# Altium project base_tiempo.PrjPcb
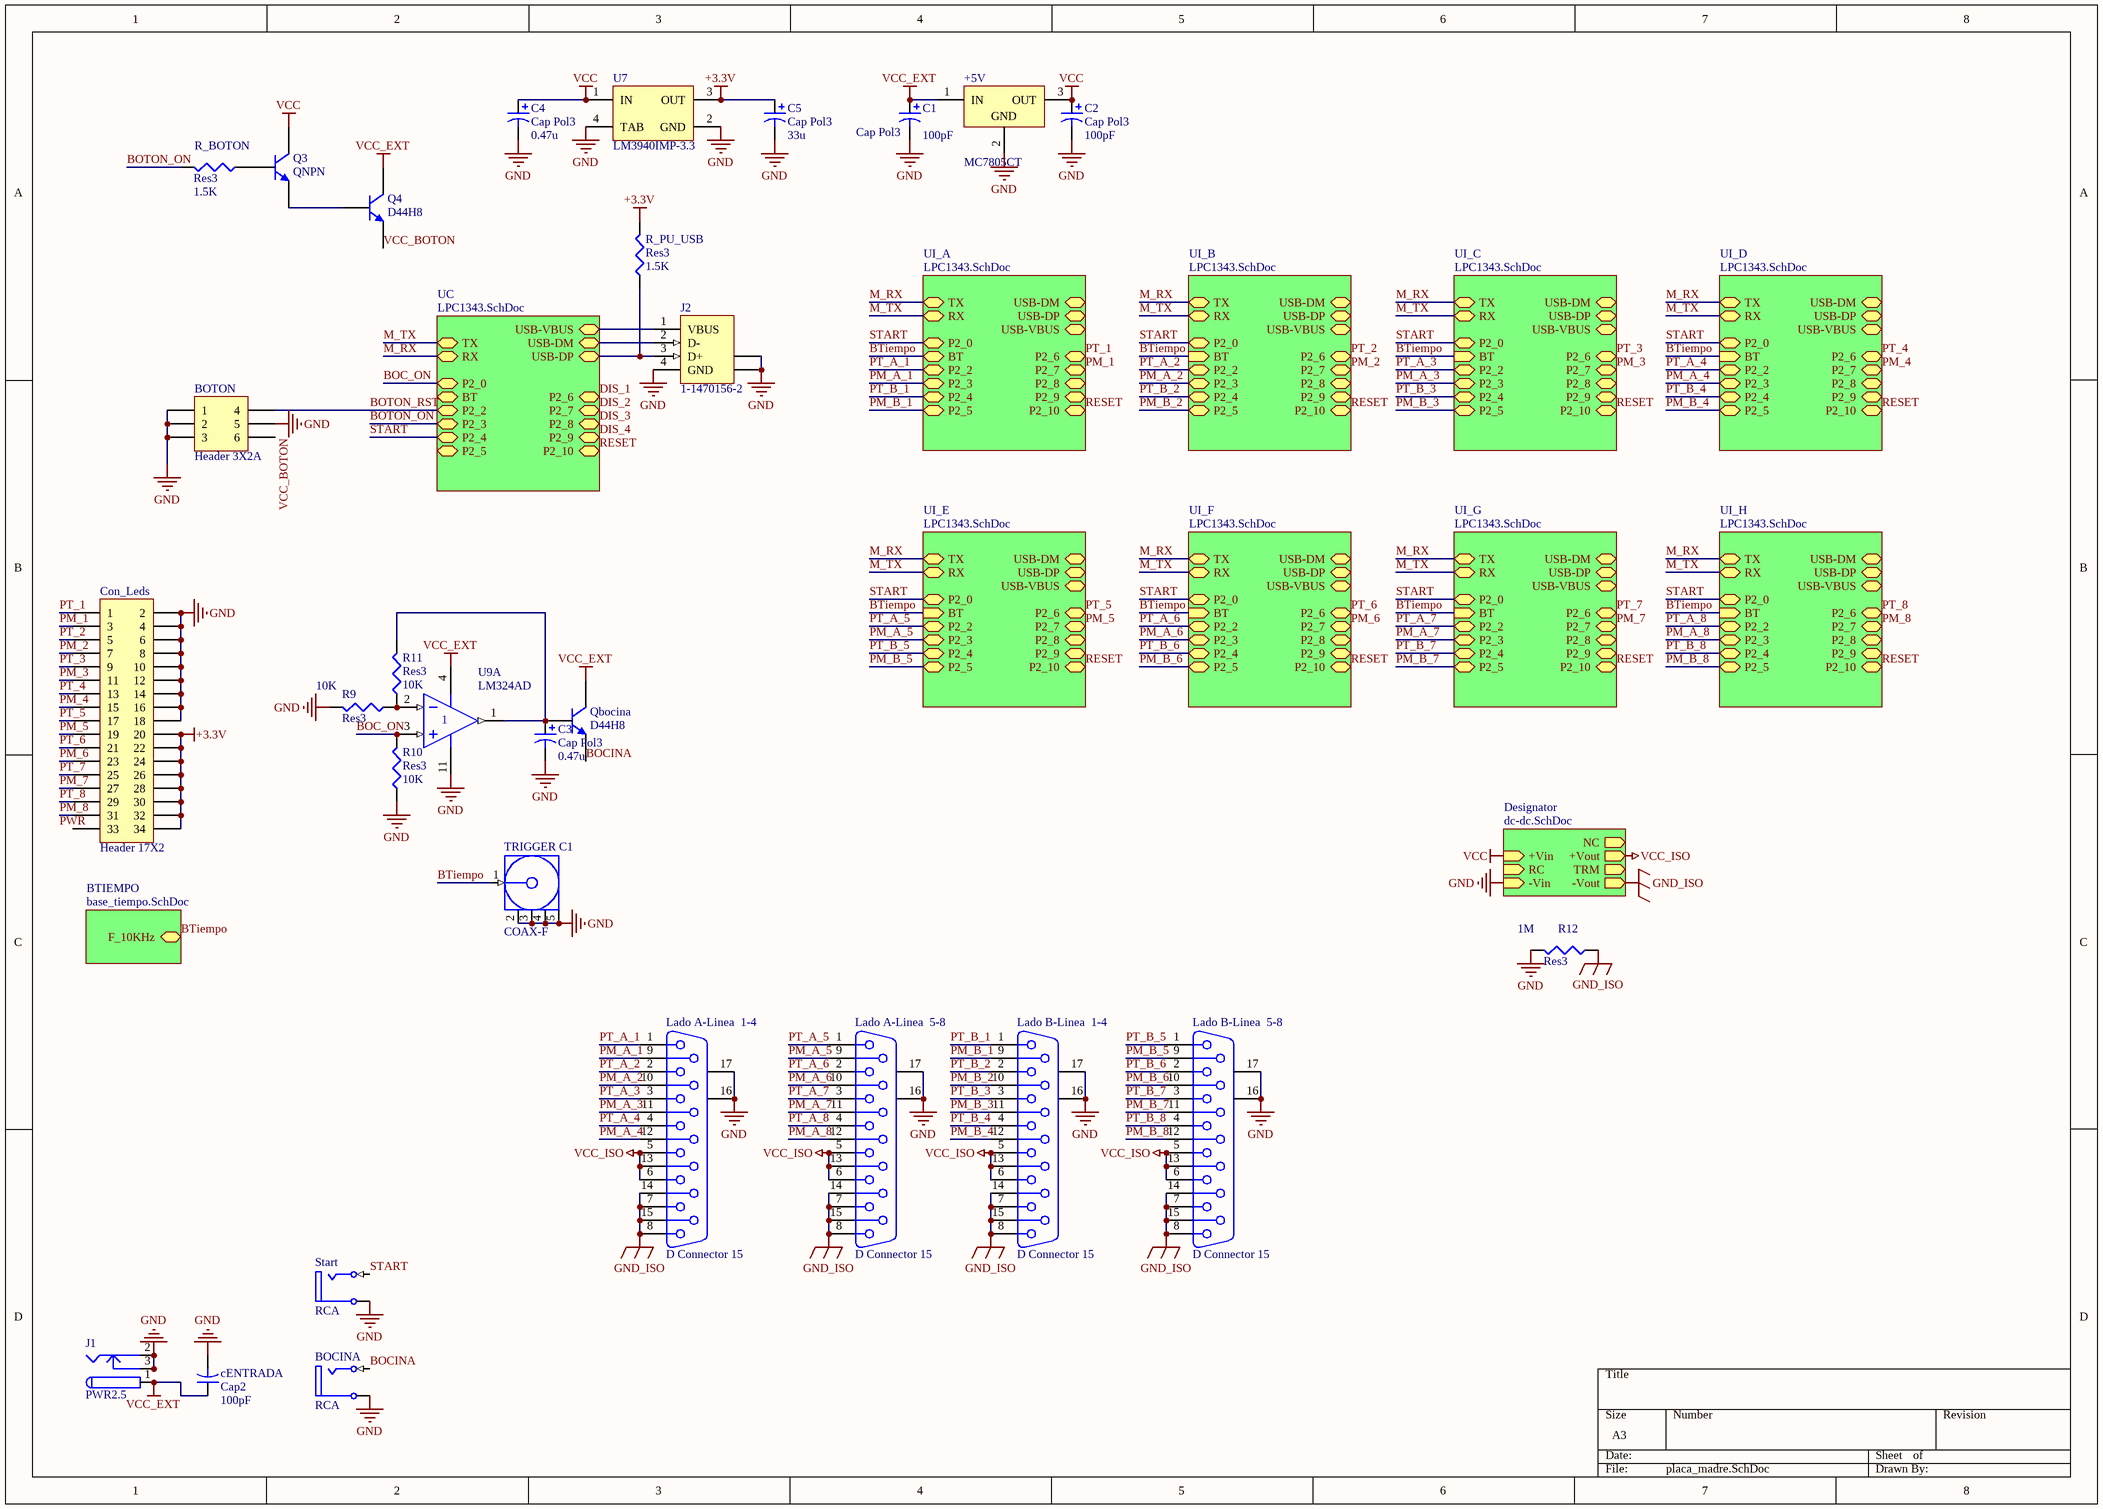
[diagram p0: placa_madre.SchDoc]
6 sheets, 185 parts. Net scope: hierarchical (ports join the sheet entries above them; power ports are global).
Board file: base_tiempo.PcbDoc
Sheets:
  placa_madre.SchDoc
    UI_A = LPC1343.SchDoc
    BTIEMPO = base_tiempo.SchDoc
      Buffer_5Bits = buffers_5bits.SchDoc
      AND_5_Entradas = AND_5_entradas.SchDoc
    UI_B = LPC1343.SchDoc
    UI_C = LPC1343.SchDoc
    UI_D = LPC1343.SchDoc
    UI_H = LPC1343.SchDoc
    UI_G = LPC1343.SchDoc
    UI_F = LPC1343.SchDoc
    UI_E = LPC1343.SchDoc
    UC = LPC1343.SchDoc
    Designator = dc-dc.SchDoc

## Sheet placa_madre.SchDoc
size A3

### Parts
+5V  MC7805CT  [221A-04]
BOCINA  RCA  [RCA/4.5-H2]
BOTON  Header 3X2A  [HDR2X3_CEN]
C1  Cap Pol3  value 100pF  [C0805]
C2  Cap Pol3  value 100pF  [C0805]
C3  Cap Pol3  value 0.47u  [C0805]
C4  Cap Pol3  value 0.47u  [C0805]
C5  Cap Pol3  value 33u  [C0805]
cENTRADA  Cap2  value 100pF  [CAPR5-4X5]
Con_Leds  Header 17X2  [HDR2X17]
J1  PWR2.5  [KLD-0202]
J2  1-1470156-2  [1-1470156]
Lado_A-Linea_1-4  D Connector 15  [DSUB1.385-2H15]
Lado_A-Linea_5-8  D Connector 15  [DSUB1.385-2H15]
Lado_B-Linea_1-4  D Connector 15  [DSUB1.385-2H15]
Lado_B-Linea_5-8  D Connector 15  [DSUB1.385-2H15]
Q3  QNPN  [SOT-23B]
Q4  D44H8  [TO-220]
Qbocina  D44H8  [TO-220]
R9  Res3  value 10K  [2012[0805]]
R10  Res3  value 10K  [2012[0805]]
R11  Res3  value 10K  [2012[0805]]
R12  Res3  value 1M  [2012[0805]]
R_BOTON  Res3  value 1.5K  [J1-0603]
R_PU_USB  Res3  value 1.5K  [2012[0805]]
Start  RCA  [RCA/4.5-H2]
TRIGGER_C1  COAX-F  [MCX5.08-H5]
U7  LM3940IMP-3.3  [MP04A_N]
U9  LM324AD  [751A-02_N]  (part A of 4)

### Sub-sheets
BTIEMPO = base_tiempo.SchDoc: F_10KHz (bidir)
Designator = dc-dc.SchDoc: -Vin (in), +Vin (in), +Vout (out), -Vout (out), RC (in), TRM (out), NC (out)
UC = LPC1343.SchDoc: TX (bidir), RX (bidir), P2_0 (bidir), BT (bidir), P2_2 (bidir), P2_3 (bidir), P2_4 (bidir), P2_5 (bidir), P2_6 (bidir), P2_7 (bidir), P2_8 (bidir), P2_9 (bidir), P2_10 (bidir), USB-DM (bidir), USB-DP (bidir), USB-VBUS
UI_A = LPC1343.SchDoc: TX (bidir), RX (bidir), P2_0 (bidir), BT (bidir), P2_2 (bidir), P2_3 (bidir), P2_4 (bidir), P2_5 (bidir), P2_6 (bidir), P2_7 (bidir), P2_8 (bidir), P2_9 (bidir), P2_10 (bidir), USB-DM (bidir), USB-DP (bidir), USB-VBUS (bidir)
UI_B = LPC1343.SchDoc: TX (bidir), RX (bidir), P2_0 (bidir), BT (in), P2_2 (bidir), P2_3 (bidir), P2_4 (bidir), P2_5 (bidir), P2_6 (bidir), P2_7 (bidir), P2_8 (bidir), P2_9 (bidir), P2_10 (bidir), USB-DM (bidir), USB-DP (bidir), USB-VBUS (bidir)
UI_C = LPC1343.SchDoc: TX (bidir), RX (bidir), P2_0 (bidir), BT (in), P2_2 (bidir), P2_3 (bidir), P2_4 (bidir), P2_5 (bidir), P2_6 (bidir), P2_7 (bidir), P2_8 (bidir), P2_9 (bidir), P2_10 (bidir), USB-DM (bidir), USB-DP (bidir), USB-VBUS (bidir)
UI_D = LPC1343.SchDoc: TX (bidir), RX (bidir), P2_0 (bidir), BT (in), P2_2 (bidir), P2_3 (bidir), P2_4 (bidir), P2_5 (bidir), P2_6 (bidir), P2_7 (bidir), P2_8 (bidir), P2_9 (bidir), P2_10 (bidir), USB-DM (bidir), USB-DP (bidir), USB-VBUS (bidir)
UI_E = LPC1343.SchDoc: TX (bidir), RX (bidir), P2_0 (bidir), BT (in), P2_2 (bidir), P2_3 (bidir), P2_4 (bidir), P2_5 (bidir), P2_6 (bidir), P2_7 (bidir), P2_8 (bidir), P2_9 (bidir), P2_10 (bidir), USB-DM (bidir), USB-DP (bidir), USB-VBUS (bidir)
UI_F = LPC1343.SchDoc: TX (bidir), RX (bidir), P2_0 (bidir), BT (in), P2_2 (bidir), P2_3 (bidir), P2_4 (bidir), P2_5 (bidir), P2_6 (bidir), P2_7 (bidir), P2_8 (bidir), P2_9 (bidir), P2_10 (bidir), USB-DM (bidir), USB-DP (bidir), USB-VBUS (bidir)
UI_G = LPC1343.SchDoc: TX (bidir), RX (bidir), P2_0 (bidir), BT (in), P2_2 (bidir), P2_3 (bidir), P2_4 (bidir), P2_5 (bidir), P2_6 (bidir), P2_7 (bidir), P2_8 (bidir), P2_9 (bidir), P2_10 (bidir), USB-DM (bidir), USB-DP (bidir), USB-VBUS (bidir)
UI_H = LPC1343.SchDoc: TX (bidir), RX (bidir), P2_0 (bidir), BT (in), P2_2 (bidir), P2_3 (bidir), P2_4 (bidir), P2_5 (bidir), P2_6 (bidir), P2_7 (bidir), P2_8 (bidir), P2_9 (bidir), P2_10 (bidir), USB-DM (bidir), USB-DP (bidir), USB-VBUS (bidir)

### Nets
+3.3V: C5.1 Con_Leds.20 Con_Leds.22 Con_Leds.24 Con_Leds.26 Con_Leds.28 Con_Leds.30 Con_Leds.32 Con_Leds.34 R_PU_USB.2 U7.3(OUT)
GND: +5V.2(GND) BOCINA.1A(Ground) BOTON.1 BOTON.2 BOTON.3 BOTON.5 C1.2 C2.2 C3.2 C4.2 C5.2 cENTRADA.2 Con_Leds.2 Con_Leds.4 Con_Leds.6 Con_Leds.8 Con_Leds.10 Con_Leds.12 Con_Leds.14 Con_Leds.16 Con_Leds.18 J1.2 J1.2A J1.2B J1.3 J1.3A J1.3B J2.4(GND) J2.5(SHLD) J2.6(SHLD) Lado_A-Linea_1-4.16(MH1) Lado_A-Linea_1-4.17(MH2) Lado_A-Linea_5-8.16(MH1) Lado_A-Linea_5-8.17(MH2) Lado_B-Linea_1-4.16(MH1) Lado_B-Linea_1-4.17(MH2) Lado_B-Linea_5-8.16(MH1) Lado_B-Linea_5-8.17(MH2) R9.2 R10.1 R12.2 Start.1A(Ground) TRIGGER_C1.2(GND) TRIGGER_C1.3(GND) TRIGGER_C1.4(GND) TRIGGER_C1.5(GND) U7.2(GND) U7.4(TAB) U9.11(V-) ; sheet Designator/-Vin
GND_ISO: Lado_A-Linea_1-4.7 Lado_A-Linea_1-4.8 Lado_A-Linea_1-4.14 Lado_A-Linea_1-4.15 Lado_A-Linea_5-8.7 Lado_A-Linea_5-8.8 Lado_A-Linea_5-8.14 Lado_A-Linea_5-8.15 Lado_B-Linea_1-4.7 Lado_B-Linea_1-4.8 Lado_B-Linea_1-4.14 Lado_B-Linea_1-4.15 Lado_B-Linea_5-8.7 Lado_B-Linea_5-8.8 Lado_B-Linea_5-8.14 Lado_B-Linea_5-8.15 R12.1 ; sheet Designator/-Vout
VCC: +5V.3(OUT) C2.1 C4.1 Q3.1(C) U7.1(IN) ; sheet Designator/+Vin
VCC_EXT: +5V.1(IN) C1.1 cENTRADA.1 J1.1 J1.1A J1.1B Q4.2(C) Qbocina.2(C) U9.4(V+)
VCC_ISO: Lado_A-Linea_1-4.5 Lado_A-Linea_1-4.6 Lado_A-Linea_1-4.13 Lado_A-Linea_5-8.5 Lado_A-Linea_5-8.6 Lado_A-Linea_5-8.13 Lado_B-Linea_1-4.5 Lado_B-Linea_1-4.6 Lado_B-Linea_1-4.13 Lado_B-Linea_5-8.5 Lado_B-Linea_5-8.6 Lado_B-Linea_5-8.13 ; sheet Designator/+Vout
36: J2.2(D-) ; sheet UC/USB-DM
37: J2.3(D+) R_PU_USB.1 ; sheet UC/USB-DP
39: J2.1(VBUS) ; sheet UC/USB-VBUS
BOC_ON: R10.2 U9.3(IN+) ; sheet UC/P2_0  [project net 12]
BOCINA: BOCINA.2B(Signal) Qbocina.3(E)
BOTON_ON: R_BOTON.2 ; sheet UC/P2_3  [project net 45]
BOTON_RST: BOTON.4 ; sheet UC/P2_2  [project net 14]
BTiempo: TRIGGER_C1.1(Signal) ; sheet UI_A/BT, sheet BTIEMPO/F_10KHz, sheet UI_B/BT, sheet UI_C/BT, sheet UI_D/BT, sheet UI_H/BT, sheet UI_G/BT, sheet UI_F/BT, sheet UI_E/BT  [project net 10KHz]
M_RX: sheet UI_A/TX, sheet UI_B/TX, sheet UI_C/TX, sheet UI_D/TX, sheet UI_H/TX, sheet UI_G/TX, sheet UI_F/TX, sheet UI_E/TX, sheet UC/RX  [project net 10]
M_TX: sheet UI_A/RX, sheet UI_B/RX, sheet UI_C/RX, sheet UI_D/RX, sheet UI_H/RX, sheet UI_G/RX, sheet UI_F/RX, sheet UI_E/RX, sheet UC/TX  [project net 10]
PM_1: Con_Leds.3 ; sheet UI_A/P2_7  [project net 49]
PM_2: Con_Leds.7 ; sheet UI_B/P2_7  [project net 49]
PM_3: Con_Leds.11 ; sheet UI_C/P2_7  [project net 49]
PM_4: Con_Leds.15 ; sheet UI_D/P2_7  [project net 49]
PM_5: Con_Leds.19 ; sheet UI_E/P2_7  [project net 49]
PM_6: Con_Leds.23 ; sheet UI_F/P2_7  [project net 49]
PM_7: Con_Leds.27 ; sheet UI_G/P2_7  [project net 49]
PM_8: Con_Leds.31 ; sheet UI_H/P2_7  [project net 49]
PM_A_1: Lado_A-Linea_1-4.9 ; sheet UI_A/P2_3  [project net 45]
PM_A_2: Lado_A-Linea_1-4.10 ; sheet UI_B/P2_3  [project net 45]
PM_A_3: Lado_A-Linea_1-4.11 ; sheet UI_C/P2_3  [project net 45]
PM_A_4: Lado_A-Linea_1-4.12 ; sheet UI_D/P2_3  [project net 45]
PM_A_5: Lado_A-Linea_5-8.9 ; sheet UI_E/P2_3  [project net 45]
PM_A_6: Lado_A-Linea_5-8.10 ; sheet UI_F/P2_3  [project net 45]
PM_A_7: Lado_A-Linea_5-8.11 ; sheet UI_G/P2_3  [project net 45]
PM_A_8: Lado_A-Linea_5-8.12 ; sheet UI_H/P2_3  [project net 45]
PM_B_1: Lado_B-Linea_1-4.9 ; sheet UI_A/P2_5  [project net 47]
PM_B_2: Lado_B-Linea_1-4.10 ; sheet UI_B/P2_5  [project net 47]
PM_B_3: Lado_B-Linea_1-4.11 ; sheet UI_C/P2_5  [project net 47]
PM_B_4: Lado_B-Linea_1-4.12 ; sheet UI_D/P2_5  [project net 47]
PM_B_5: Lado_B-Linea_5-8.9 ; sheet UI_E/P2_5  [project net 47]
PM_B_6: Lado_B-Linea_5-8.10 ; sheet UI_F/P2_5  [project net 47]
PM_B_7: Lado_B-Linea_5-8.11 ; sheet UI_G/P2_5  [project net 47]
PM_B_8: Lado_B-Linea_5-8.12 ; sheet UI_H/P2_5  [project net 47]
PT_1: Con_Leds.1 ; sheet UI_A/P2_6  [project net 48]
PT_2: Con_Leds.5 ; sheet UI_B/P2_6  [project net 48]
PT_3: Con_Leds.9 ; sheet UI_C/P2_6  [project net 48]
PT_4: Con_Leds.13 ; sheet UI_D/P2_6  [project net 48]
PT_5: Con_Leds.17 ; sheet UI_E/P2_6  [project net 48]
PT_6: Con_Leds.21 ; sheet UI_F/P2_6  [project net 48]
PT_7: Con_Leds.25 ; sheet UI_G/P2_6  [project net 48]
PT_8: Con_Leds.29 ; sheet UI_H/P2_6  [project net 48]
PT_A_1: Lado_A-Linea_1-4.1 ; sheet UI_A/P2_2  [project net 14]
PT_A_2: Lado_A-Linea_1-4.2 ; sheet UI_B/P2_2  [project net 14]
PT_A_3: Lado_A-Linea_1-4.3 ; sheet UI_C/P2_2  [project net 14]
PT_A_4: Lado_A-Linea_1-4.4 ; sheet UI_D/P2_2  [project net 14]
PT_A_5: Lado_A-Linea_5-8.1 ; sheet UI_E/P2_2  [project net 14]
PT_A_6: Lado_A-Linea_5-8.2 ; sheet UI_F/P2_2  [project net 14]
PT_A_7: Lado_A-Linea_5-8.3 ; sheet UI_G/P2_2  [project net 14]
PT_A_8: Lado_A-Linea_5-8.4 ; sheet UI_H/P2_2  [project net 14]
PT_B_1: Lado_B-Linea_1-4.1 ; sheet UI_A/P2_4  [project net 46]
PT_B_2: Lado_B-Linea_1-4.2 ; sheet UI_B/P2_4  [project net 46]
PT_B_3: Lado_B-Linea_1-4.3 ; sheet UI_C/P2_4  [project net 46]
PT_B_4: Lado_B-Linea_1-4.4 ; sheet UI_D/P2_4  [project net 46]
PT_B_5: Lado_B-Linea_5-8.1 ; sheet UI_E/P2_4  [project net 46]
PT_B_6: Lado_B-Linea_5-8.2 ; sheet UI_F/P2_4  [project net 46]
PT_B_7: Lado_B-Linea_5-8.3 ; sheet UI_G/P2_4  [project net 46]
PT_B_8: Lado_B-Linea_5-8.4 ; sheet UI_H/P2_4  [project net 46]
RESET: sheet UI_A/P2_10, sheet UI_B/P2_10, sheet UI_C/P2_10, sheet UI_D/P2_10, sheet UI_H/P2_10, sheet UI_G/P2_10, sheet UI_F/P2_10, sheet UI_E/P2_10, sheet UC/P2_10  [project net 52]
START: Start.2B(Signal) ; sheet UI_A/P2_0, sheet UI_B/P2_0, sheet UI_C/P2_0, sheet UI_D/P2_0, sheet UI_H/P2_0, sheet UI_G/P2_0, sheet UI_F/P2_0, sheet UI_E/P2_0, sheet UC/P2_4  [project net 12]
VCC_BOTON: BOTON.6 Q4.3(E)
NetC3_1: C3.1 Qbocina.1(B) R11.2 U9.1(OUT)
NetQ3_2: Q3.2(B) R_BOTON.1
NetQ3_3: Q3.3(E) Q4.1(B)
NetR9_1: R9.1 R11.1 U9.2(IN-)

Not connected (* = marked no-connect by the designer): Con_Leds 33

### Notes on the sheet
- Labels drawn without touching a wire or pin: PWR

### Library data of the parts
+5V = MC7805CT: 3-Terminal Positive Fixed Voltage Regulator; Note: Pin 2 is electrically connected to TAB; Published: 17-Jul-2002; DatasheetVersion: 1988; PackageReference: 221A-04; Publisher: Altium Limited; PackageDescription: TO, Thru-Hole, Vertical, Heatsink Mounted; 3 In-Line Leads; Pitch 2.54 mm; Code_JEDEC: TO-262-AA; ComponentLink1Description: Manufacturer Link; ComponentLink1URL: http://www.onsemi.com/site/products/taxonomy/0,4438,503,00.html; ComponentLink2Description: Datasheet; ComponentLink2URL: http://www.onsemi.com/pub/Collateral/MC7800-D.PDF
BOCINA Start = RCA: RCA Phono Jack, Right Angle, Thru-Hole, Snap-In; PCB_Layout: Complies with manufacturer's recommendation.; DrillAndSlotSize: Corresponds to nominal value.; Published: 15-Jul-2004; LatestRevisionDate: 15-Jul-2004; LatestRevisionNote: Component Replaced.; DatasheetDocument: 7-Jul-2000; PackageDocument: 7-Jul-2000; PackageReference: 161; Publisher: Altium Limited; ComponentLink1Description: Manufacturer Link; ComponentLink1URL: http://www.mouser.com/kobiconn/
BOTON = Header 3X2A: Header, 3-Pin, Dual row; LatestRevisionDate: 17-Jul-2002; LatestRevisionNote: Re-released for DXP Platform.; Publisher: Altium Limited
C1-C5 = Cap Pol3: Polarized Capacitor (Surface Mount); Published: 8-Jun-2000; LatestRevisionDate: 29-May-2009; LatestRevisionNote: IPC-7351 Footprint Added.; PackageReference: C0805; Publisher: Altium Limited; PackageDescription: Chip Capacitor
cENTRADA = Cap2: Capacitor; Published: 23-Sep-2002; PackageReference: CAPR5-4X5; Publisher: Altium Limited
Con_Leds = Header 17X2: Header, 17-Pin, Dual row; LatestRevisionDate: 17-Jul-2002; LatestRevisionNote: Re-released for DXP Platform.; Publisher: Altium Limited
J1 = PWR2.5: Low Voltage Power Supply Connector; Published: 17-Dec-2003; DatasheetDocument: 09-May-2002; Publisher: Altium Limited; ComponentLink1Description: Manufacturer Link; ComponentLink1URL: http://domino.kycon.com/internet/Products.html
J2 = 1-1470156-2: USB 1.1, Right Angle, Thru-Hole, B Type, Receptacle, 4 Position, Black; ContactMaterial: Phosphor Bronze; ContactPlating: Gold over Nickel; TerminationLength: 3.00mm [0.118in.]; PCB_Layout: Complies with manufacturer's recommendation.; DrillSize: Corresponds to nominal value.; PanelGround: Without; Published: 15-Jul-2004; DatasheetDocument: 02-Jun-2001; PackageDocument: 02-Jun-2001; PackageReference: 1-1470156; Publisher: Altium Limited; HousingMaterial: Glass-Filled Thermoplastic; ComponentLink1Description: Manufacturer Link; ComponentLink1URL: http://www.tycoelectronics.com/; ComponentLink2Description: Packaging Specification; ComponentLink2URL: http://ecommas.tycoelectronics.com/commerce/DocumentDelivery/DDEController?Action=showdoc&DocId=Customer+Drawing%7F1470156%7FO%7Ftif%7FEnglish%7FC_1470156_O.tif
Lado_A-Linea_1-4 Lado_A-Linea_5-8 Lado_B-Linea_1-4 Lado_B-Linea_5-8 = D Connector 15: Receptacle Assembly, 15 Position, Right Angle; PackageDocument: O; Positions: 15; Published: 15-Jun-2001; LatestRevisionDate: 17-Jul-2002; LatestRevisionNote: Re-released for DXP Platform.; DatasheetDocument: 1-Sep-99; PackageReference: 788757; Publisher: Altium Limited; Orientation: Right Angle; Gender: Receptacle
Q3 = QNPN: NPN Bipolar Transistor; Published: 8-Jun-2000; LatestRevisionDate: 17-Jul-2002; LatestRevisionNote: Re-released for DXP Platform.; PackageReference: SOT-23B; Publisher: Altium Limited; Code_JEDEC: SOT-23
Q4 Qbocina = D44H8: NPN Power Amplifier; Published: 8-Jun-2000; LatestRevisionDate: 17-Jul-2002; LatestRevisionNote: Re-released for DXP Platform.; DatasheetDocument: 1997; PackageDocument: Sep-1998; PackageReference: TO-220; Publisher: Altium Limited; Code_JEDEC: TO-220-AB-alt; ComponentLink1Description: Manufacturer Link; ComponentLink1URL: http://www.fairchildsemi.com/
R9-R12 R_BOTON R_PU_USB = Res3: Resistor; Published: 8-Jun-2000; LatestRevisionDate: 29-May-2009; LatestRevisionNote: IPC-7351 Footprint Added.; PackageReference: J1-0603; Publisher: Altium Limited; PackageDescription: Chip Resistor
TRIGGER_C1 = COAX-F: RF Coaxial PCB Connector, MCX; Thru-Hole, Right-Angle Mount Socket, Blunt Post Terminal, 50 Ohm Impedance; PCB_Layout: Complies with manufacturer's recommendation.; DrillSize: Corresponds to nominal value.; Published: 15-Jul-2004; LatestRevisionDate: 15-Jul-2004; LatestRevisionNote: Component Replaced.; DatasheetDocument: 30-May-2003; PackageDocument: 04-Jul-1999; PackageReference: 919-119J-51AX; Publisher: Altium Limited; ComponentLink1Description: Manufacturer Link; ComponentLink1URL: http://www.amphenolrf.com/
U7 = LM3940IMP-3.3: 1A Low Dropout Regulator for 5V to 3.3V Conversion, 4-pin SOT-223; Manufacturer: National Semiconductor; PackageTopMarking: XYTT*L52B; PowerWise: N; CompType: LDO IC; Published: 4-Dec-2008; DatasheetVersion: Jul-2007; PackageVersion: revB, Apr-2003; PackageReference: MP04A; Publisher: Altium Limited; PackageDescription: Molded SOT-223, 6.50 x 3.56 x 1.6mm Body, 4 Lead, 2.3mm Pitch; Supplier 1: Farnell; Supplier Part Number 1: 9779280; PartNumber: LM3940IMP-3.3; RoHS: N; PinCount: 4; Code_JEDEC: TO-261-AA; Code_IPC: SOT223-4; ComponentLink1Description: LM3940 Datasheet; ComponentLink1URL: http://www.national.com/ds/LM/LM3940.pdf; ComponentLink2Description: LM3940 Web Page; ComponentLink2URL: http://www.national.com/pf/LM/LM3940.html; ComponentLink3Description: MP04A Package Page; ComponentLink3URL: http://www.national.com/packaging/folders/mp04a.html
U9 = LM324AD: Quad Low-Power Operational Amplifier; Published: 17-Jul-2002; LatestRevisionDate: 13-Apr-2006; LatestRevisionNote: IPC-7351 Footprint Added.; DatasheetVersion: 1988; PackageVersion: 1991; PackageReference: 751A-02; Publisher: Altium Limited; PackageDescription: 14-Pin Small Outline Integrated Circuit 1.27 mm Pitch; Code_IPC: SOIC127P600-14; ComponentLink1Description: Manufacturer Link; ComponentLink1URL: http://www.onsemi.com/site/products/parametrics/0,4446,251,00.html; ComponentLink2Description: Datasheet; ComponentLink2URL: http://www.onsemi.com/pub/Collateral/LM324-D.PDF

## Sheet LPC1343.SchDoc
size A4
Used 9 times, as channels UI_A, UI_B, UI_C, UI_D, UI_H, UI_G, UI_F, UI_E, UC. Parts and nets are listed once, with the designators drawn on the sheet.
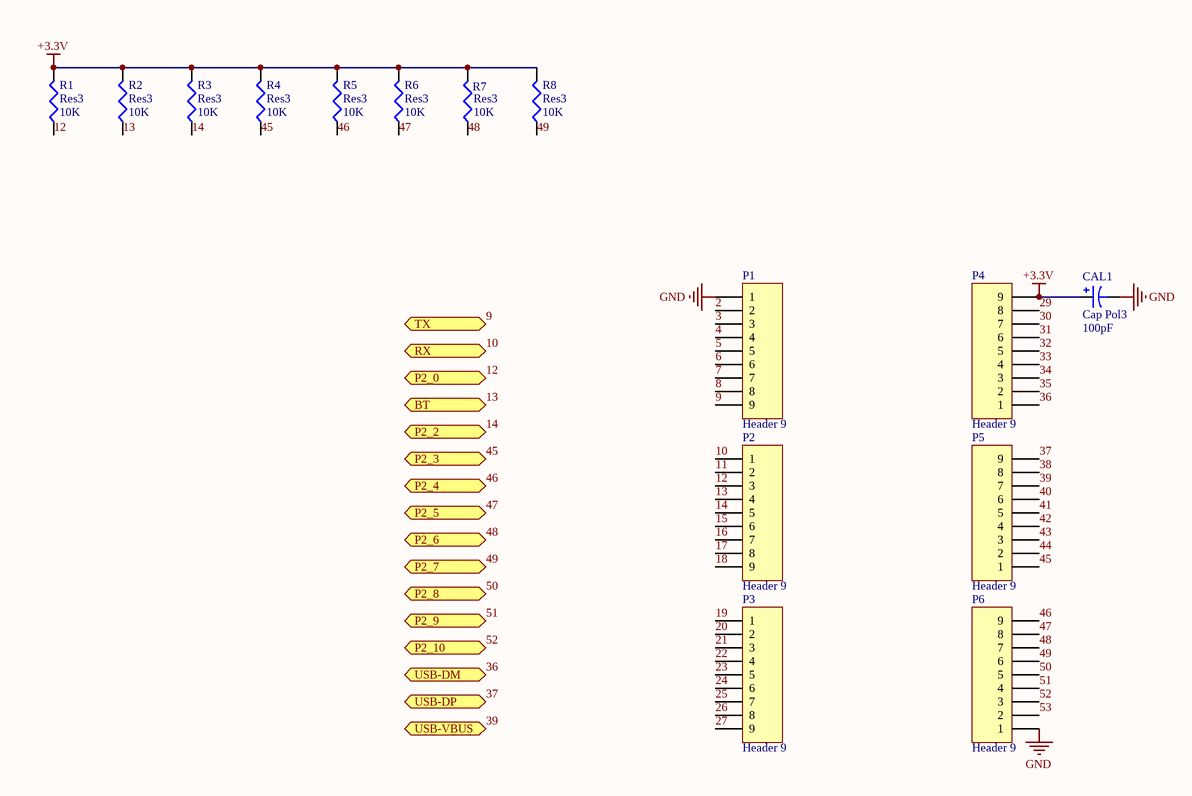
[diagram p1: LPC1343.SchDoc]

### Parts
CAL1  Cap Pol3  value 100pF  [C0805]
P1  Header 9  [HDR1X9]
P2  Header 9  [HDR1X9]
P3  Header 9  [HDR1X9]
P4  Header 9  [HDR1X9]
P5  Header 9  [HDR1X9]
P6  Header 9  [HDR1X9]
R1  Res3  value 10K  [2012[0805]]
R2  Res3  value 10K  [2012[0805]]
R3  Res3  value 10K  [2012[0805]]
R4  Res3  value 10K  [2012[0805]]
R5  Res3  value 10K  [2012[0805]]
R6  Res3  value 10K  [2012[0805]]
R7  Res3  value 10K  [2012[0805]]
R8  Res3  value 10K  [2012[0805]]

### Ports
BT (in), P2_0 (bidir), P2_2 (bidir), P2_3 (bidir), P2_4 (bidir), P2_5 (bidir), P2_6 (bidir), P2_7 (bidir), P2_8 (bidir), P2_9 (bidir), P2_10 (bidir), RX (bidir), TX (bidir), USB-DM (bidir), USB-DP (bidir), USB-VBUS

### Nets
+3.3V: CAL1.1 P4.9 R1.2 R2.2 R3.2 R4.2 R5.2 R6.2 R7.2 R8.2
GND: CAL1.2 P1.1 P6.1
2: P1.2
3: P1.3
4: P1.4
5: P1.5
6: P1.6
7: P1.7
8: P1.8
9: P1.9 ; port TX
10: P2.1 ; port RX
11: P2.2
12: P2.3 R1.1 ; port P2_0
13: P2.4 R2.1 ; port BT
14: P2.5 R3.1 ; port P2_2
15: P2.6
16: P2.7
17: P2.8
18: P2.9
19: P3.1
20: P3.2
21: P3.3
22: P3.4
23: P3.5
24: P3.6
25: P3.7
26: P3.8
27: P3.9
29: P4.8
30: P4.7
31: P4.6
32: P4.5
33: P4.4
34: P4.3
35: P4.2
36: P4.1 ; port USB-DM
37: P5.9 ; port USB-DP
38: P5.8
39: P5.7 ; port USB-VBUS
40: P5.6
41: P5.5
42: P5.4
43: P5.3
44: P5.2
45: P5.1 R4.1 ; port P2_3
46: P6.9 R5.1 ; port P2_4
47: P6.8 R6.1 ; port P2_5
48: P6.7 R7.1 ; port P2_6
49: P6.6 R8.1 ; port P2_7
50: P6.5 ; port P2_8
51: P6.4 ; port P2_9
52: P6.3 ; port P2_10
53: P6.2

### Channels
UI_A: designators end in _UI_A; ports BT=10KHz P2_0=12 P2_2=14 P2_3=45 P2_4=46 P2_5=47 P2_6=48 P2_7=49 P2_8=50_UI_A P2_9=51_UI_A P2_10=52 RX=10 TX=10 USB-DM=36_UI_A USB-DP=37_UI_A USB-VBUS=39_UI_A
UI_B: designators end in _UI_B; ports BT=10KHz P2_0=12 P2_2=14 P2_3=45 P2_4=46 P2_5=47 P2_6=48 P2_7=49 P2_8=50_UI_B P2_9=51_UI_B P2_10=52 RX=10 TX=10 USB-DM=36_UI_B USB-DP=37_UI_B USB-VBUS=39_UI_B
UI_C: designators end in _UI_C; ports BT=10KHz P2_0=12 P2_2=14 P2_3=45 P2_4=46 P2_5=47 P2_6=48 P2_7=49 P2_8=50_UI_C P2_9=51_UI_C P2_10=52 RX=10 TX=10 USB-DM=36_UI_C USB-DP=37_UI_C USB-VBUS=39_UI_C
UI_D: designators end in _UI_D; ports BT=10KHz P2_0=12 P2_2=14 P2_3=45 P2_4=46 P2_5=47 P2_6=48 P2_7=49 P2_8=50_UI_D P2_9=51_UI_D P2_10=52 RX=10 TX=10 USB-DM=36_UI_D USB-DP=37_UI_D USB-VBUS=39_UI_D
UI_H: designators end in _UI_H; ports BT=10KHz P2_0=12 P2_2=14 P2_3=45 P2_4=46 P2_5=47 P2_6=48 P2_7=49 P2_8=50_UI_H P2_9=51_UI_H P2_10=52 RX=10 TX=10 USB-DM=36_UI_H USB-DP=37_UI_H USB-VBUS=39_UI_H
UI_G: designators end in _UI_G; ports BT=10KHz P2_0=12 P2_2=14 P2_3=45 P2_4=46 P2_5=47 P2_6=48 P2_7=49 P2_8=50_UI_G P2_9=51_UI_G P2_10=52 RX=10 TX=10 USB-DM=36_UI_G USB-DP=37_UI_G USB-VBUS=39_UI_G
UI_F: designators end in _UI_F; ports BT=10KHz P2_0=12 P2_2=14 P2_3=45 P2_4=46 P2_5=47 P2_6=48 P2_7=49 P2_8=50_UI_F P2_9=51_UI_F P2_10=52 RX=10 TX=10 USB-DM=36_UI_F USB-DP=37_UI_F USB-VBUS=39_UI_F
UI_E: designators end in _UI_E; ports BT=10KHz P2_0=12 P2_2=14 P2_3=45 P2_4=46 P2_5=47 P2_6=48 P2_7=49 P2_8=50_UI_E P2_9=51_UI_E P2_10=52 RX=10 TX=10 USB-DM=36_UI_E USB-DP=37_UI_E USB-VBUS=39_UI_E
UC: designators end in _UC; ports BT=13_UC P2_0=12 P2_2=14 P2_3=45 P2_4=12 P2_5=47_UC P2_6=48_UC P2_7=49_UC P2_8=50_UC P2_9=51_UC P2_10=52 RX=10 TX=10 USB-DM=36 USB-DP=37 USB-VBUS=39

### Library data of the parts
CAL1 = Cap Pol3: Polarized Capacitor (Surface Mount); Published: 8-Jun-2000; LatestRevisionDate: 17-Jul-2002; LatestRevisionNote: Re-released for DXP Platform.; PackageReference: C0805; Publisher: Altium Limited
P1-P6 = Header 9: Header, 9-Pin; LatestRevisionDate: 17-Jul-2002; LatestRevisionNote: Re-released for DXP Platform.; Publisher: Altium Limited
R1-R8 = Res3: Resistor; Published: 8-Jun-2000; LatestRevisionDate: 29-May-2009; LatestRevisionNote: IPC-7351 Footprint Added.; PackageReference: J1-0603; Publisher: Altium Limited; PackageDescription: Chip Resistor

## Sheet base_tiempo.SchDoc: Base de tiempo
size A4; Revision: 1
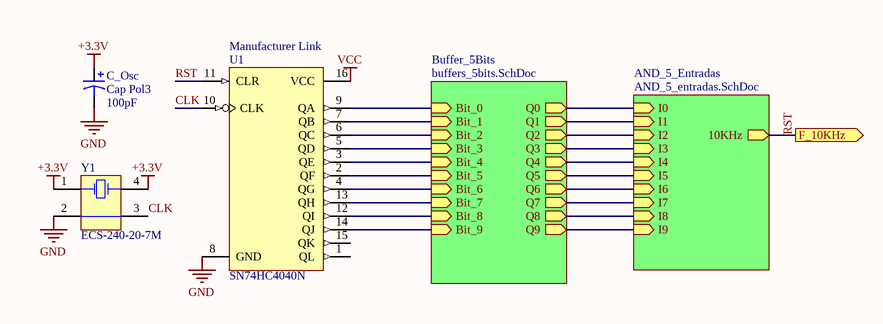
[diagram p2: base_tiempo.SchDoc]

### Parts
C_Osc  Cap Pol3  value 100pF  [C0805]
U1  SN74HC4040N  ComponentLink1Description: Manufacturer Link  [N016]
Y1  ECS-240-20-7M  [ECX-3M]

### Sub-sheets
AND_5_Entradas = AND_5_entradas.SchDoc: I0 (in), I1 (in), I2 (in), I3 (in), I4 (in), 10KHz (out), I5 (in), I6 (in), I7 (in), I8 (in), I9 (in)
Buffer_5Bits = buffers_5bits.SchDoc: Bit_0 (in), Bit_1 (in), Bit_2 (in), Bit_3 (in), Bit_4 (in), Q0 (out), Q1 (out), Q2 (out), Q3 (out), Q4 (out), Bit_5 (in), Bit_6 (in), Bit_7 (in), Bit_8 (in), Bit_9 (in), Q5 (out), Q6 (out), Q7 (out), Q8 (out), Q9 (out)

### Ports
F_10KHz (out)

### Nets
+3.3V: C_Osc.1 Y1.1(OSC1) Y1.4(OSC2)
GND: C_Osc.2 U1.8(GND) Y1.2(COM)
VCC: U1.16(VCC)
B_0: U1.9(QA) ; sheet Buffer_5Bits/Bit_0
B_1: U1.7(QB) ; sheet Buffer_5Bits/Bit_1
B_2: U1.6(QC) ; sheet Buffer_5Bits/Bit_2
B_3: U1.5(QD) ; sheet Buffer_5Bits/Bit_3
B_4: U1.3(QE) ; sheet Buffer_5Bits/Bit_4
B_5: U1.2(QF) ; sheet Buffer_5Bits/Bit_5
B_6: U1.4(QG) ; sheet Buffer_5Bits/Bit_6
B_7: U1.13(QH) ; sheet Buffer_5Bits/Bit_7
B_8: U1.12(QI) ; sheet Buffer_5Bits/Bit_8
B_9: U1.14(QJ) ; sheet Buffer_5Bits/Bit_9
CLK: U1.10(CLK) Y1.3(COM)
Q_0: sheet Buffer_5Bits/Q0, sheet AND_5_Entradas/I0
Q_1: sheet Buffer_5Bits/Q1, sheet AND_5_Entradas/I1
Q_2: sheet Buffer_5Bits/Q2, sheet AND_5_Entradas/I2
Q_3: sheet Buffer_5Bits/Q3, sheet AND_5_Entradas/I3
Q_4: sheet Buffer_5Bits/Q4, sheet AND_5_Entradas/I4
Q_5: sheet Buffer_5Bits/Q5, sheet AND_5_Entradas/I5
Q_6: sheet Buffer_5Bits/Q6, sheet AND_5_Entradas/I6
Q_7: sheet Buffer_5Bits/Q7, sheet AND_5_Entradas/I7
Q_8: sheet Buffer_5Bits/Q8, sheet AND_5_Entradas/I8
Q_9: sheet Buffer_5Bits/Q9, sheet AND_5_Entradas/I9
RST: U1.11(CLR) ; port F_10KHz, sheet AND_5_Entradas/10KHz  [project net 10KHz]

Not connected (* = marked no-connect by the designer): U1 1(QL) 15(QK)

### Library data of the parts
C_Osc = Cap Pol3: Polarized Capacitor (Surface Mount); Published: 8-Jun-2000; LatestRevisionDate: 17-Jul-2002; LatestRevisionNote: Re-released for DXP Platform.; PackageReference: C0805; Publisher: Altium Limited
U1 = SN74HC4040N: 12-Bit Asynchronous Binary Counter; Published: 8-Jun-2000; LatestRevisionDate: 04-Mar-2005; LatestRevisionNote: Stylized 3D Model Added.; DatasheetVersion: May-1997; PackageVersion: Oct-1995; PackageReference: N016; Publisher: Altium Limited; PackageDescription: DIP; 16 Leads; Row Spacing 7.62 mm; Pitch 2.54 mm; Code_JEDEC: MS-001-BB; ComponentLink1URL: http://www.ti.com/; ComponentLink2Description: Datasheet; ComponentLink2URL: http://www-s.ti.com/sc/ds/sn74hc4040.pdf
Y1 = ECS-240-20-7M: Crystal Oscillator; Published: 17-Jul-2002; DatasheetDocument: 18-Apr-2000; PackageReference: ECX-3M; Publisher: Altium Limited; ComponentLink1Description: Manufacturer Link; ComponentLink1URL: http://www.ecsxtal.com/

## Sheet buffers_5bits.SchDoc
size A4
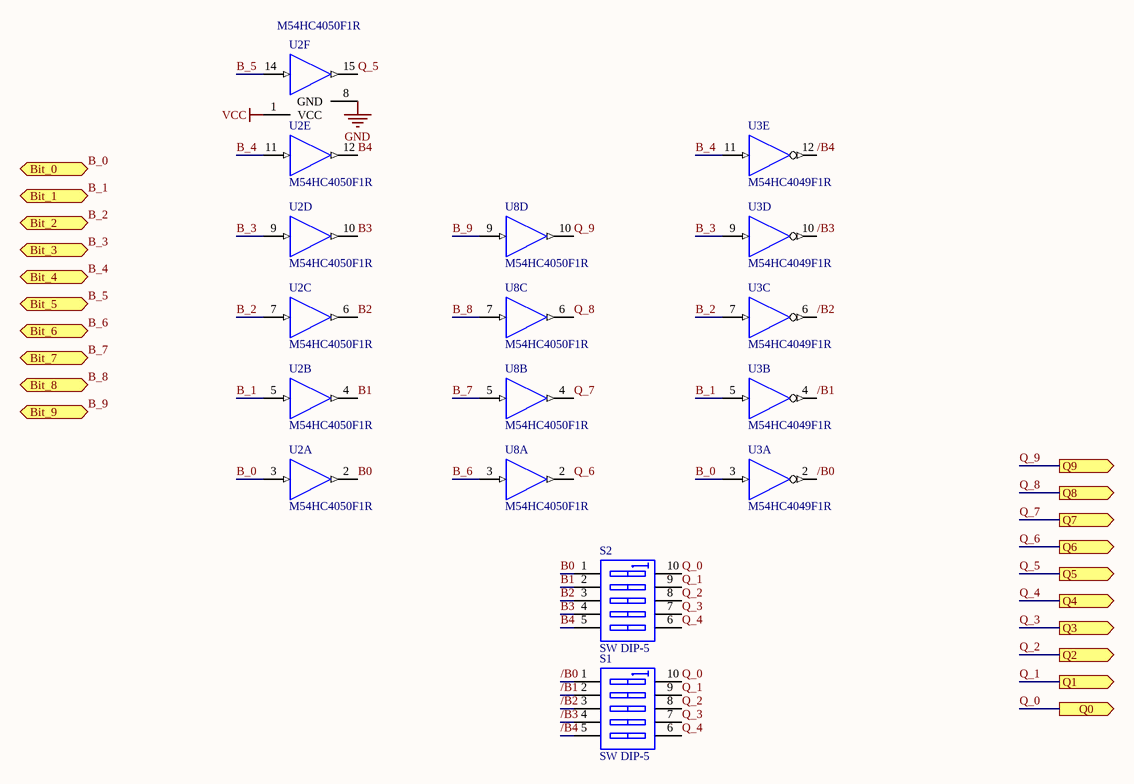
[diagram p3: buffers_5bits.SchDoc]

### Parts
S1  SW DIP-5  [N10A]
S2  SW DIP-5  [N10A]
U2  M54HC4050F1R  [DIP16]  (parts A,B,C,D,E,F of 6)
U3  M54HC4049F1R  [DIP16]  (parts A,B,C,D,E of 6)
U8  M54HC4050F1R  [DIP16]  (parts A,B,C,D of 6)

### Ports
Bit_0 (in), Bit_1 (in), Bit_2 (in), Bit_3 (in), Bit_4 (in), Bit_5 (in), Bit_6 (in), Bit_7 (in), Bit_8 (in), Bit_9 (in), Q0 (out), Q1 (out), Q2 (out), Q3 (out), Q4 (out), Q5 (out), Q6 (out), Q7 (out), Q8 (out), Q9 (out)

### Nets
GND: U2.8(GND) U3.8(GND) U8.8(GND)
VCC: U2.1(VCC) U3.1(VCC) U8.1(VCC)
/B0: S1.1(A1) U3.2(Y)
/B1: S1.2(A2) U3.4(Y)
/B2: S1.3(A3) U3.6(Y)
/B3: S1.4(A4) U3.10(Y)
/B4: S1.5(A5) U3.12(Y)
B0: S2.1(A1) U2.2(Y)
B1: S2.2(A2) U2.4(Y)
B2: S2.3(A3) U2.6(Y)
B3: S2.4(A4) U2.10(Y)
B4: S2.5(A5) U2.12(Y)
B_0: U2.3(A) U3.3(A) ; port Bit_0
B_1: U2.5(A) U3.5(A) ; port Bit_1
B_2: U2.7(A) U3.7(A) ; port Bit_2
B_3: U2.9(A) U3.9(A) ; port Bit_3
B_4: U2.11(A) U3.11(A) ; port Bit_4
B_5: U2.14(A) ; port Bit_5
B_6: U8.3(A) ; port Bit_6
B_7: U8.5(A) ; port Bit_7
B_8: U8.7(A) ; port Bit_8
B_9: U8.9(A) ; port Bit_9
Q_0: S1.10(B1) S2.10(B1) ; port Q0
Q_1: S1.9(B2) S2.9(B2) ; port Q1
Q_2: S1.8(B3) S2.8(B3) ; port Q2
Q_3: S1.7(B4) S2.7(B4) ; port Q3
Q_4: S1.6(B5) S2.6(B5) ; port Q4
Q_5: U2.15(Y) ; port Q5
Q_6: U8.2(Y) ; port Q6
Q_7: U8.4(Y) ; port Q7
Q_8: U8.6(Y) ; port Q8
Q_9: U8.10(Y) ; port Q9

### Library data of the parts
S1 S2 = SW DIP-5: DIP Switch, 5 Position, SPST; Published: 24-Mar-1999; LatestRevisionDate: 17-Jul-2002; LatestRevisionNote: Re-released for DXP Platform.; PackageReference: N10A; Publisher: Altium Limited
U2 U8 = M54HC4050F1R: Hex Buffer/Converter Non-Inverting; Note: Pins 13 and 16 are not connected and not drawn.; Published: 8-Jun-2000; LatestRevisionDate: 06-Jun-2005; LatestRevisionNote: Stylized 3D Model Added.; DatasheetVersion: Mar-1993; PackageVersion: Apr-1996; PackageReference: DIP16; Publisher: Altium Limited; PackageDescription: DIP; 16 Leads; Row Spacing 7.62 mm; Pitch 2.54 mm; ComponentLink1Description: Manufacturer Link; ComponentLink1URL: http://www.st.com/
U3 = M54HC4049F1R: Hex Buffer/Converter Invertering; Note: Pins 13 and 16 are not connected and not drawn.; Published: 8-Jun-2000; LatestRevisionDate: 06-Jun-2005; LatestRevisionNote: Stylized 3D Model Added.; DatasheetVersion: Mar-1993; PackageVersion: Apr-1996; PackageReference: DIP16; Publisher: Altium Limited; PackageDescription: DIP; 16 Leads; Row Spacing 7.62 mm; Pitch 2.54 mm; ComponentLink1Description: Manufacturer Link; ComponentLink1URL: http://www.st.com/

## Sheet AND_5_entradas.SchDoc
size A4; PageSetup: Record=PageOptions|CenterHorizontal=True|CenterVertical=True|PrintScale=0.97|XCorrection=1.00|YCorrection=1.00|PrintKind=2|BorderSize=5000000|LeftOffset=0|BottomOffset=0|Orientation=2|PaperLength=1000|PaperWidth=1000|Scale=100|PaperSource=7|PrintQuality=-4|MediaType=1|DitherType=10|PaperKind=A4|PrintScaleMode=1
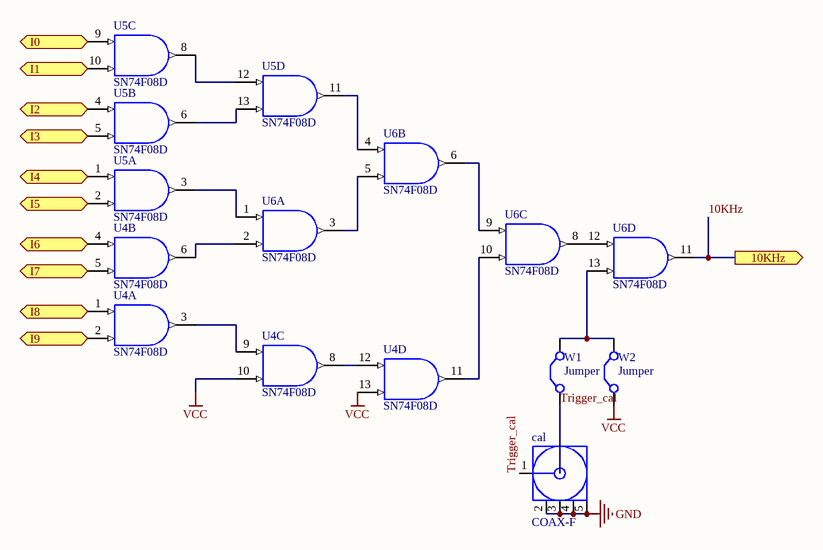
[diagram p4: AND_5_entradas.SchDoc]

### Parts
cal  COAX-F  [MCX5.08-H5]
U4  SN74F08D  [D014_N]  (parts A,B,C,D of 4)
U5  SN74F08D  [D014_N]  (parts A,B,C,D of 4)
U6  SN74F08D  [D014_N]  (parts A,B,C,D of 4)
W1  Jumper  [RAD-0.2]
W2  Jumper  [RAD-0.2]

### Ports
10KHz (out), I0 (in), I1 (in), I2 (in), I3 (in), I4 (in), I5 (in), I6 (in), I7 (in), I8 (in), I9 (in)

### Nets
GND: cal.2(GND) cal.3(GND) cal.4(GND) cal.5(GND) U4.7(GND) U5.7(GND) U6.7(GND)
VCC: U4.10(B) U4.13(B) U4.14(VCC) U5.14(VCC) U6.14(VCC) W2.1(C1)
10KHz: U6.11(Y) ; port 10KHz
Q_0: U5.9(A) ; port I0
Q_1: U5.10(B) ; port I1
Q_2: U5.4(A) ; port I2
Q_3: U5.5(B) ; port I3
Q_4: U5.1(A) ; port I4
Q_5: U5.2(B) ; port I5
Q_6: U4.4(A) ; port I6
Q_7: U4.5(B) ; port I7
Q_8: U4.1(A) ; port I8
Q_9: U4.2(B) ; port I9
Trigger_cal: cal.1(Signal) W1.1(C1)
NetU4_3: U4.3(Y) U4.9(A)
NetU4_6: U4.6(Y) U6.2(B)
NetU4_8: U4.8(Y) U4.12(A)
NetU4_11: U4.11(Y) U6.10(B)
NetU5_3: U5.3(Y) U6.1(A)
NetU5_6: U5.6(Y) U5.13(B)
NetU5_8: U5.8(Y) U5.12(A)
NetU5_11: U5.11(Y) U6.4(A)
NetU6_3: U6.3(Y) U6.5(B)
NetU6_6: U6.6(Y) U6.9(A)
NetU6_8: U6.8(Y) U6.12(A)
NetU6_13: U6.13(B) W1.2(C2) W2.2(C2)

### Library data of the parts
cal = COAX-F: as TRIGGER_C1 on sheet placa_madre; Published: 15-Jul-2004; LatestRevisionDate: 15-Jul-2004; LatestRevisionNote: Component Replaced.; DatasheetDocument: 30-May-2003; PackageDocument: 04-Jul-1999; PackageReference: 919-119J-51AX; Publisher: Altium Limited; ComponentLink1Description: Manufacturer Link; ComponentLink1URL: http://www.amphenolrf.com/
U4-U6 = SN74F08D: Quadruple 2-Input Positive-AND Gate; Published: 8-Jun-2000; LatestRevisionDate: 13-Apr-2006; LatestRevisionNote: IPC-7351 Footprint Added.; DatasheetVersion: Oct-1993; PackageVersion: Jan-1998; PackageReference: D014; Publisher: Altium Limited; PackageDescription: 14-Pin Small Outline Integrated Circuit 1.27 mm Pitch; Code_IPC: SOIC127P600-14; ComponentLink1Description: Manufacturer Link; ComponentLink1URL: http://www.ti.com/; ComponentLink2Description: Datasheet; ComponentLink2URL: http://www-s.ti.com/sc/ds/SN74F08.pdf
W1 W2 = Jumper: Jumper Wire; Published: 24-Mar-1999; LatestRevisionDate: 17-Jul-2002; LatestRevisionNote: Re-released for DXP Platform.; PackageReference: RAD-0.2; Publisher: Altium Limited

## Sheet dc-dc.SchDoc
size A4
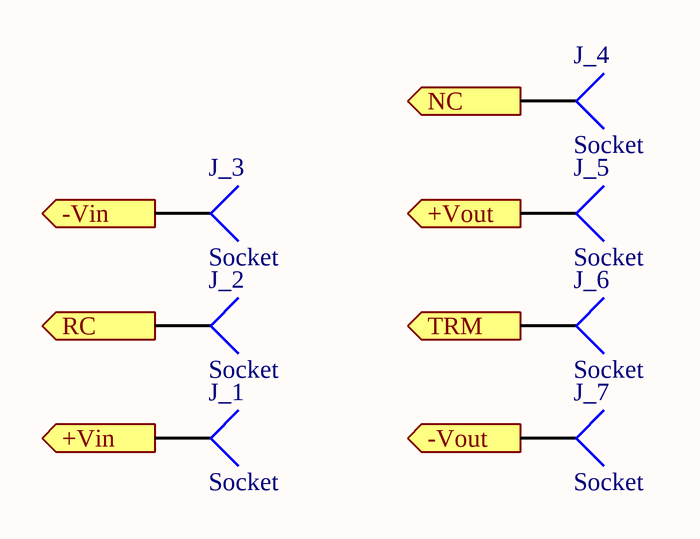
[diagram p5: dc-dc.SchDoc]

### Parts
J_1  Socket  [PIN1]
J_2  Socket  [PIN1]
J_3  Socket  [PIN1]
J_4  Socket  [PIN1]
J_5  Socket  [PIN1]
J_6  Socket  [PIN1]
J_7  Socket  [PIN1]

### Ports
+Vin (in), +Vout (out), -Vin (in), -Vout (out), NC (out), RC (in), TRM (out)

### Nets
GND: J_3.1 ; port -Vin
GND_ISO: J_7.1 ; port -Vout
VCC: J_1.1 ; port +Vin
VCC_ISO: J_5.1 ; port +Vout
NetJ_2_1: J_2.1 ; port RC
NetJ_4_1: J_4.1 ; port NC
NetJ_6_1: J_6.1 ; port TRM

### Library data of the parts
J_1-J_7 = Socket: LatestRevisionDate: 17-Jul-2002; LatestRevisionNote: Re-released for DXP Platform.; Publisher: Altium Limited

## Nets that join several sheets
+3.3V: placa_madre (11 pins), UI_A (10 pins), base_tiempo (C_Osc.1 Y1.1 Y1.4), UI_B (10 pins), UI_C (10 pins), UI_D (10 pins), UI_H (10 pins), UI_G (10 pins), UI_F (10 pins), UI_E (10 pins), UC (10 pins)
GND: placa_madre (49 pins), UI_A (CAL1_UI_A.2 P1_UI_A.1 P6_UI_A.1), base_tiempo (C_Osc.2 U1.8 Y1.2), buffers_5bits (U2.8 U3.8 U8.8), AND_5_entradas (7 pins), UI_B (CAL1_UI_B.2 P1_UI_B.1 P6_UI_B.1), UI_C (CAL1_UI_C.2 P1_UI_C.1 P6_UI_C.1), UI_D (CAL1_UI_D.2 P1_UI_D.1 P6_UI_D.1), UI_H (CAL1_UI_H.2 P1_UI_H.1 P6_UI_H.1), UI_G (CAL1_UI_G.2 P1_UI_G.1 P6_UI_G.1), UI_F (CAL1_UI_F.2 P1_UI_F.1 P6_UI_F.1), UI_E (CAL1_UI_E.2 P1_UI_E.1 P6_UI_E.1), UC (CAL1_UC.2 P1_UC.1 P6_UC.1), dc-dc (J_3.1)
GND_ISO: placa_madre (17 pins), dc-dc (J_7.1)
VCC: placa_madre (5 pins), base_tiempo (U1.16), buffers_5bits (U2.1 U3.1 U8.1), AND_5_entradas (6 pins), dc-dc (J_1.1)
VCC_ISO: placa_madre (12 pins), dc-dc (J_5.1)
10: UI_A (P1_UI_A.9), UI_B (P1_UI_B.9), UI_C (P1_UI_C.9), UI_D (P1_UI_D.9), UI_H (P1_UI_H.9), UI_G (P1_UI_G.9), UI_F (P1_UI_F.9), UI_E (P1_UI_E.9), UC (P2_UC.1)
10: UI_A (P2_UI_A.1), UI_B (P2_UI_B.1), UI_C (P2_UI_C.1), UI_D (P2_UI_D.1), UI_H (P2_UI_H.1), UI_G (P2_UI_G.1), UI_F (P2_UI_F.1), UI_E (P2_UI_E.1), UC (P1_UC.9)
10KHz: placa_madre (TRIGGER_C1.1), UI_A (P2_UI_A.4 R2_UI_A.1), base_tiempo (U1.11), AND_5_entradas (U6.11), UI_B (P2_UI_B.4 R2_UI_B.1), UI_C (P2_UI_C.4 R2_UI_C.1), UI_D (P2_UI_D.4 R2_UI_D.1), UI_H (P2_UI_H.4 R2_UI_H.1), UI_G (P2_UI_G.4 R2_UI_G.1), UI_F (P2_UI_F.4 R2_UI_F.1), UI_E (P2_UI_E.4 R2_UI_E.1)
12: placa_madre (Start.2B), UI_A (P2_UI_A.3 R1_UI_A.1), UI_B (P2_UI_B.3 R1_UI_B.1), UI_C (P2_UI_C.3 R1_UI_C.1), UI_D (P2_UI_D.3 R1_UI_D.1), UI_H (P2_UI_H.3 R1_UI_H.1), UI_G (P2_UI_G.3 R1_UI_G.1), UI_F (P2_UI_F.3 R1_UI_F.1), UI_E (P2_UI_E.3 R1_UI_E.1), UC (P6_UC.9 R5_UC.1)
12: placa_madre (R10.2 U9.3), UC (P2_UC.3 R1_UC.1)
14: placa_madre (BOTON.4), UC (P2_UC.5 R3_UC.1)
14: placa_madre (Lado_A-Linea_1-4.1), UI_A (P2_UI_A.5 R3_UI_A.1)
14: placa_madre (Lado_A-Linea_1-4.2), UI_B (P2_UI_B.5 R3_UI_B.1)
14: placa_madre (Lado_A-Linea_1-4.3), UI_C (P2_UI_C.5 R3_UI_C.1)
14: placa_madre (Lado_A-Linea_1-4.4), UI_D (P2_UI_D.5 R3_UI_D.1)
14: placa_madre (Lado_A-Linea_5-8.1), UI_E (P2_UI_E.5 R3_UI_E.1)
14: placa_madre (Lado_A-Linea_5-8.2), UI_F (P2_UI_F.5 R3_UI_F.1)
14: placa_madre (Lado_A-Linea_5-8.3), UI_G (P2_UI_G.5 R3_UI_G.1)
14: placa_madre (Lado_A-Linea_5-8.4), UI_H (P2_UI_H.5 R3_UI_H.1)
36: placa_madre (J2.2), UC (P4_UC.1)
37: placa_madre (J2.3 R_PU_USB.1), UC (P5_UC.9)
39: placa_madre (J2.1), UC (P5_UC.7)
45: placa_madre (R_BOTON.2), UC (P5_UC.1 R4_UC.1)
45: placa_madre (Lado_A-Linea_1-4.9), UI_A (P5_UI_A.1 R4_UI_A.1)
45: placa_madre (Lado_A-Linea_1-4.10), UI_B (P5_UI_B.1 R4_UI_B.1)
45: placa_madre (Lado_A-Linea_1-4.11), UI_C (P5_UI_C.1 R4_UI_C.1)
45: placa_madre (Lado_A-Linea_1-4.12), UI_D (P5_UI_D.1 R4_UI_D.1)
45: placa_madre (Lado_A-Linea_5-8.9), UI_E (P5_UI_E.1 R4_UI_E.1)
45: placa_madre (Lado_A-Linea_5-8.10), UI_F (P5_UI_F.1 R4_UI_F.1)
45: placa_madre (Lado_A-Linea_5-8.11), UI_G (P5_UI_G.1 R4_UI_G.1)
45: placa_madre (Lado_A-Linea_5-8.12), UI_H (P5_UI_H.1 R4_UI_H.1)
46: placa_madre (Lado_B-Linea_5-8.1), UI_E (P6_UI_E.9 R5_UI_E.1)
46: placa_madre (Lado_B-Linea_5-8.2), UI_F (P6_UI_F.9 R5_UI_F.1)
46: placa_madre (Lado_B-Linea_5-8.3), UI_G (P6_UI_G.9 R5_UI_G.1)
46: placa_madre (Lado_B-Linea_5-8.4), UI_H (P6_UI_H.9 R5_UI_H.1)
46: placa_madre (Lado_B-Linea_1-4.1), UI_A (P6_UI_A.9 R5_UI_A.1)
46: placa_madre (Lado_B-Linea_1-4.2), UI_B (P6_UI_B.9 R5_UI_B.1)
46: placa_madre (Lado_B-Linea_1-4.3), UI_C (P6_UI_C.9 R5_UI_C.1)
46: placa_madre (Lado_B-Linea_1-4.4), UI_D (P6_UI_D.9 R5_UI_D.1)
47: placa_madre (Lado_B-Linea_5-8.9), UI_E (P6_UI_E.8 R6_UI_E.1)
47: placa_madre (Lado_B-Linea_5-8.10), UI_F (P6_UI_F.8 R6_UI_F.1)
47: placa_madre (Lado_B-Linea_5-8.11), UI_G (P6_UI_G.8 R6_UI_G.1)
47: placa_madre (Lado_B-Linea_5-8.12), UI_H (P6_UI_H.8 R6_UI_H.1)
47: placa_madre (Lado_B-Linea_1-4.9), UI_A (P6_UI_A.8 R6_UI_A.1)
47: placa_madre (Lado_B-Linea_1-4.10), UI_B (P6_UI_B.8 R6_UI_B.1)
47: placa_madre (Lado_B-Linea_1-4.11), UI_C (P6_UI_C.8 R6_UI_C.1)
47: placa_madre (Lado_B-Linea_1-4.12), UI_D (P6_UI_D.8 R6_UI_D.1)
48: placa_madre (Con_Leds.1), UI_A (P6_UI_A.7 R7_UI_A.1)
48: placa_madre (Con_Leds.5), UI_B (P6_UI_B.7 R7_UI_B.1)
48: placa_madre (Con_Leds.9), UI_C (P6_UI_C.7 R7_UI_C.1)
48: placa_madre (Con_Leds.13), UI_D (P6_UI_D.7 R7_UI_D.1)
48: placa_madre (Con_Leds.17), UI_E (P6_UI_E.7 R7_UI_E.1)
48: placa_madre (Con_Leds.21), UI_F (P6_UI_F.7 R7_UI_F.1)
48: placa_madre (Con_Leds.25), UI_G (P6_UI_G.7 R7_UI_G.1)
48: placa_madre (Con_Leds.29), UI_H (P6_UI_H.7 R7_UI_H.1)
49: placa_madre (Con_Leds.3), UI_A (P6_UI_A.6 R8_UI_A.1)
49: placa_madre (Con_Leds.7), UI_B (P6_UI_B.6 R8_UI_B.1)
49: placa_madre (Con_Leds.11), UI_C (P6_UI_C.6 R8_UI_C.1)
49: placa_madre (Con_Leds.15), UI_D (P6_UI_D.6 R8_UI_D.1)
49: placa_madre (Con_Leds.19), UI_E (P6_UI_E.6 R8_UI_E.1)
49: placa_madre (Con_Leds.23), UI_F (P6_UI_F.6 R8_UI_F.1)
49: placa_madre (Con_Leds.27), UI_G (P6_UI_G.6 R8_UI_G.1)
49: placa_madre (Con_Leds.31), UI_H (P6_UI_H.6 R8_UI_H.1)
52: UI_A (P6_UI_A.3), UI_B (P6_UI_B.3), UI_C (P6_UI_C.3), UI_D (P6_UI_D.3), UI_H (P6_UI_H.3), UI_G (P6_UI_G.3), UI_F (P6_UI_F.3), UI_E (P6_UI_E.3), UC (P6_UC.3)
B_0: base_tiempo (U1.9), buffers_5bits (U2.3 U3.3)
B_1: base_tiempo (U1.7), buffers_5bits (U2.5 U3.5)
B_2: base_tiempo (U1.6), buffers_5bits (U2.7 U3.7)
B_3: base_tiempo (U1.5), buffers_5bits (U2.9 U3.9)
B_4: base_tiempo (U1.3), buffers_5bits (U2.11 U3.11)
B_5: base_tiempo (U1.2), buffers_5bits (U2.14)
B_6: base_tiempo (U1.4), buffers_5bits (U8.3)
B_7: base_tiempo (U1.13), buffers_5bits (U8.5)
B_8: base_tiempo (U1.12), buffers_5bits (U8.7)
B_9: base_tiempo (U1.14), buffers_5bits (U8.9)
Q_0: buffers_5bits (S1.10 S2.10), AND_5_entradas (U5.9)
Q_1: buffers_5bits (S1.9 S2.9), AND_5_entradas (U5.10)
Q_2: buffers_5bits (S1.8 S2.8), AND_5_entradas (U5.4)
Q_3: buffers_5bits (S1.7 S2.7), AND_5_entradas (U5.5)
Q_4: buffers_5bits (S1.6 S2.6), AND_5_entradas (U5.1)
Q_5: buffers_5bits (U2.15), AND_5_entradas (U5.2)
Q_6: buffers_5bits (U8.2), AND_5_entradas (U4.4)
Q_7: buffers_5bits (U8.4), AND_5_entradas (U4.5)
Q_8: buffers_5bits (U8.6), AND_5_entradas (U4.1)
Q_9: buffers_5bits (U8.10), AND_5_entradas (U4.2)